# Altium schematic sheet LPCB218 - HEC1-4.SchDoc
size A3; Address1: Factory 10; Address2: 9-13 Dingley Avenue, Dandeong, VICTORIA 3175, AUSTRALIA; DocumentNumber: 6; Revision: 1; SheetNumber: 6; SheetTotal: 14; Lockie__PCB_SUB_ASSEMBLY: HEC 1-4; Lockie__PCB_ASSEMBLY: Command Node; Lockie__LDL: LPCB218; Lockie__PCB_DESCRIPTION: Command Node
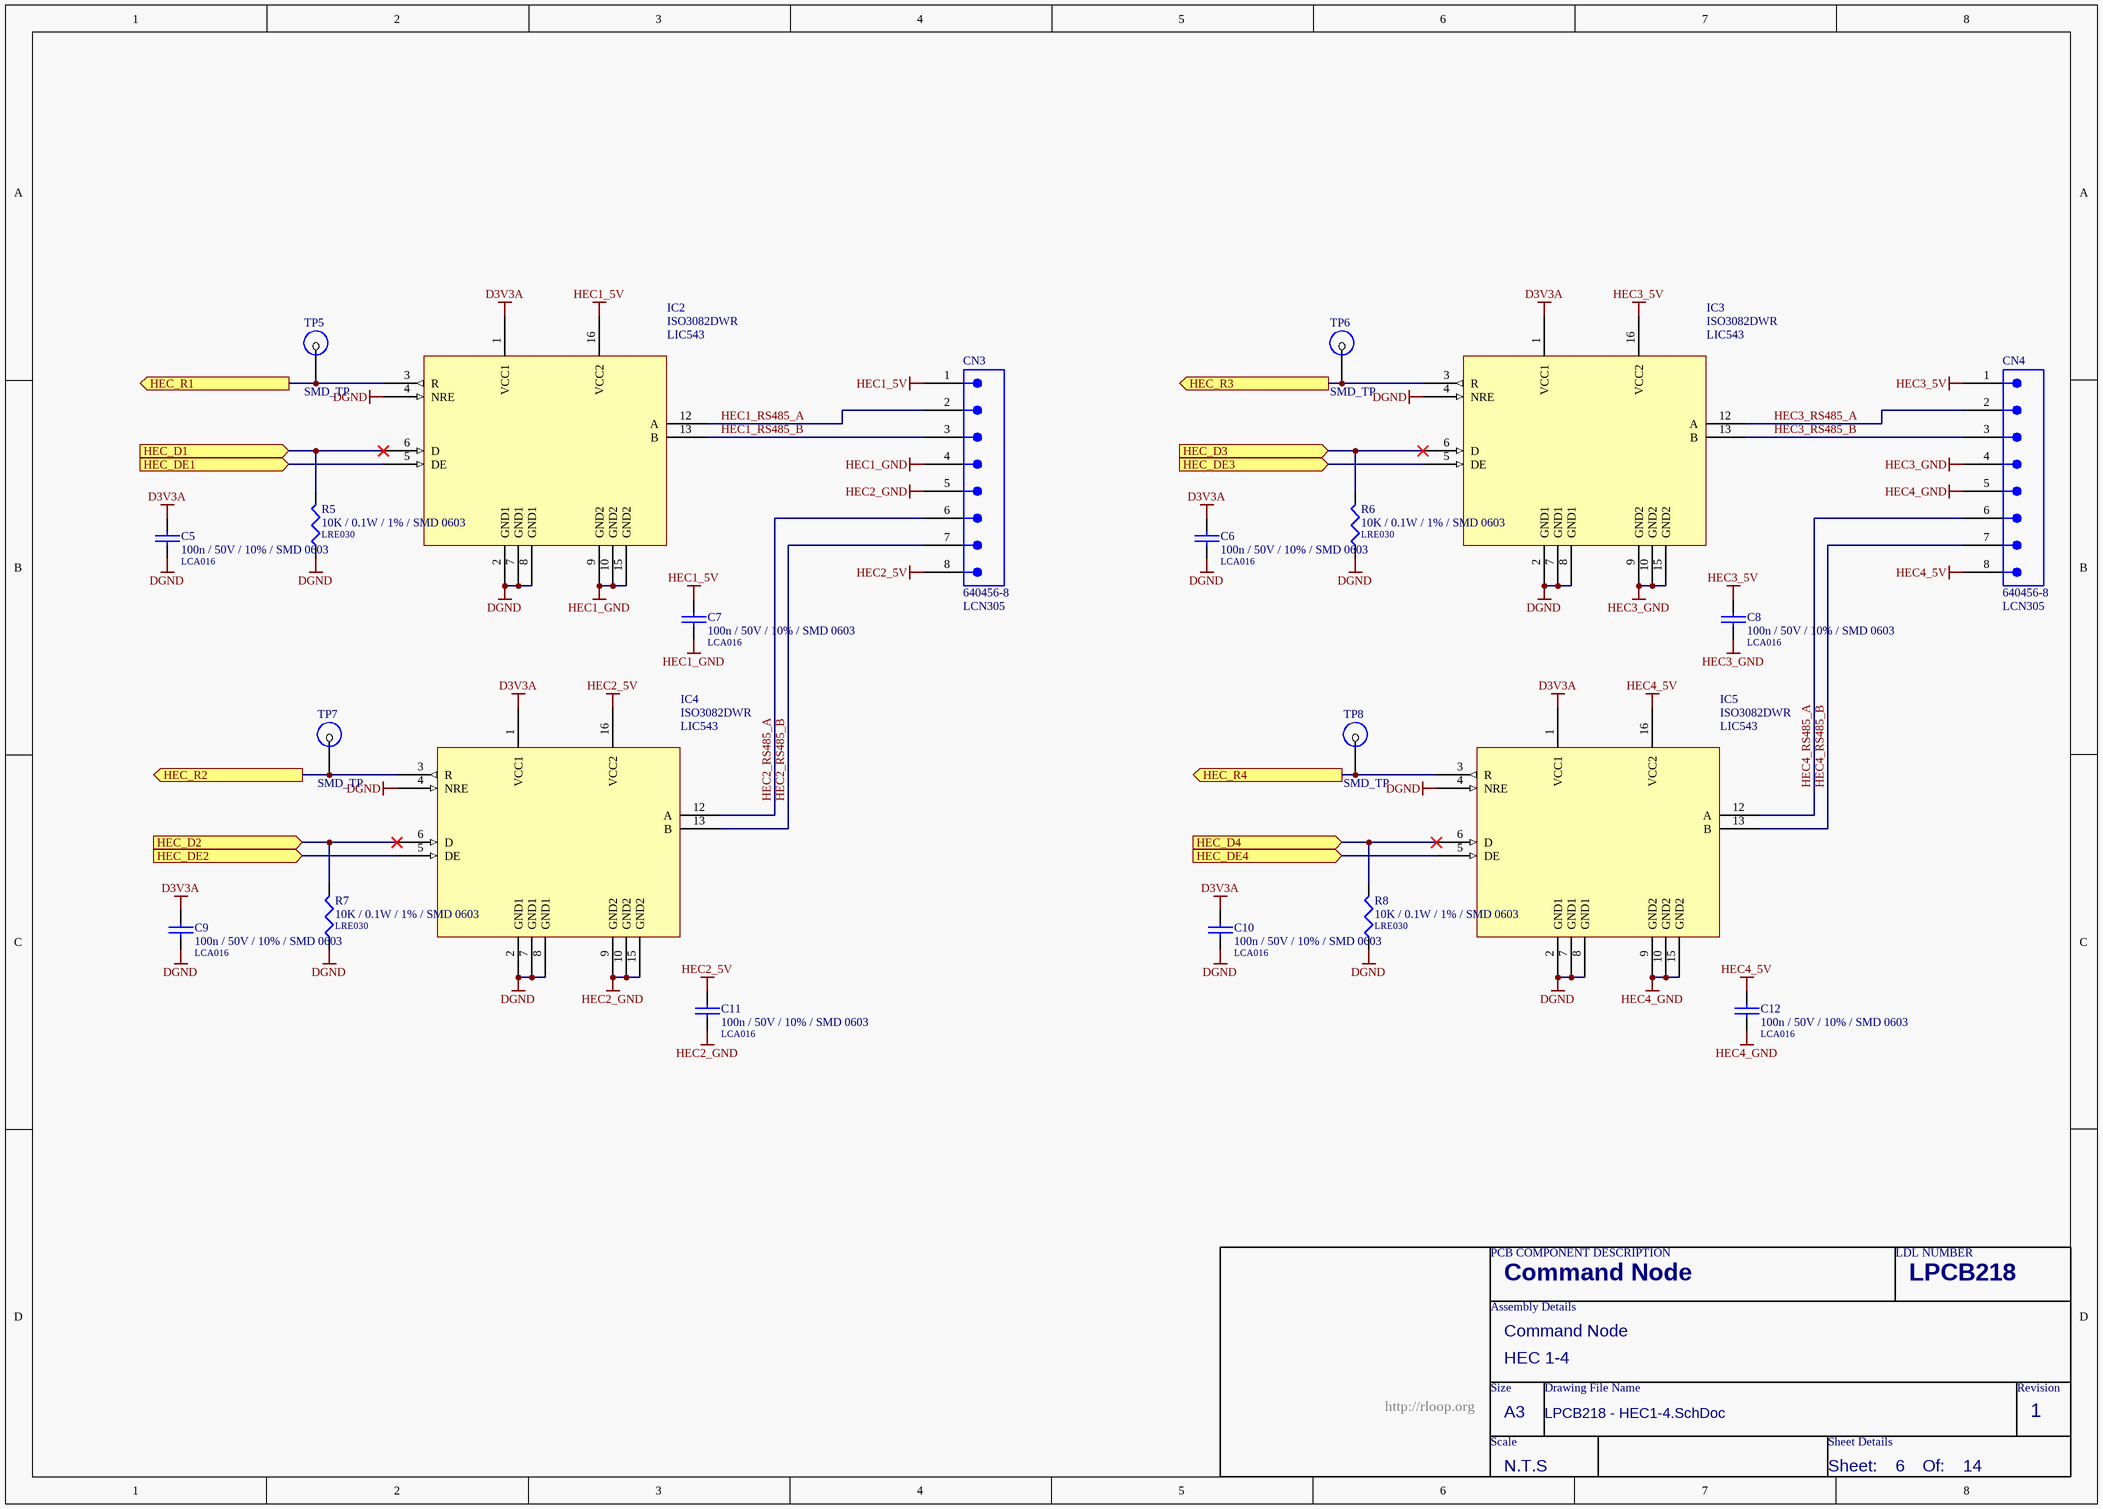
[diagram p0: LPCB218 - HEC1-4.SchDoc]

## Parts
C5  100n / 50V / 10% / SMD 0603  LDL_NUMBER: LCA016  [LFP011__CC1608-0603-IPC7351_B]
C6  100n / 50V / 10% / SMD 0603  LDL_NUMBER: LCA016  [LFP011__CC1608-0603-IPC7351_B]
C7  100n / 50V / 10% / SMD 0603  LDL_NUMBER: LCA016  [LFP011__CC1608-0603-IPC7351_B]
C8  100n / 50V / 10% / SMD 0603  LDL_NUMBER: LCA016  [LFP011__CC1608-0603-IPC7351_B]
C9  100n / 50V / 10% / SMD 0603  LDL_NUMBER: LCA016  [LFP011__CC1608-0603-IPC7351_B]
C10  100n / 50V / 10% / SMD 0603  LDL_NUMBER: LCA016  [LFP011__CC1608-0603-IPC7351_B]
C11  100n / 50V / 10% / SMD 0603  LDL_NUMBER: LCA016  [LFP011__CC1608-0603-IPC7351_B]
C12  100n / 50V / 10% / SMD 0603  LDL_NUMBER: LCA016  [LFP011__CC1608-0603-IPC7351_B]
CN3  640456-8  LDL_NUMBER: LCN305  [640456-8]
CN4  640456-8  LDL_NUMBER: LCN305  [640456-8]
IC2  ISO3082DWR  LDL_NUMBER: LIC543  [LFP068__SO-G16/G6.9]
IC3  ISO3082DWR  LDL_NUMBER: LIC543  [LFP068__SO-G16/G6.9]
IC4  ISO3082DWR  LDL_NUMBER: LIC543  [LFP068__SO-G16/G6.9]
IC5  ISO3082DWR  LDL_NUMBER: LIC543  [LFP068__SO-G16/G6.9]
R5  10K / 0.1W / 1% / SMD 0603  LDL_NUMBER: LRE030  [LFP020__CR1608-0603-IPC7351_B]
R6  10K / 0.1W / 1% / SMD 0603  LDL_NUMBER: LRE030  [LFP020__CR1608-0603-IPC7351_B]
R7  10K / 0.1W / 1% / SMD 0603  LDL_NUMBER: LRE030  [LFP020__CR1608-0603-IPC7351_B]
R8  10K / 0.1W / 1% / SMD 0603  LDL_NUMBER: LRE030  [LFP020__CR1608-0603-IPC7351_B]
TP5  SMD_TP  [SMD-TP]  (no BOM)
TP6  SMD_TP  [SMD-TP]  (no BOM)
TP7  SMD_TP  [SMD-TP]  (no BOM)
TP8  SMD_TP  [SMD-TP]  (no BOM)

## Ports
HEC_D1 (in), HEC_D2 (in), HEC_D3 (in), HEC_D4 (in), HEC_DE1 (in), HEC_DE2 (in), HEC_DE3 (in), HEC_DE4 (in), HEC_R1 (out), HEC_R2 (out), HEC_R3 (out), HEC_R4 (out)

## Nets
D3V3A: C5.1 C6.1 C9.1 C10.1 IC2.1(VCC1) IC3.1(VCC1) IC4.1(VCC1) IC5.1(VCC1)
DGND: C5.2 C6.2 C9.2 C10.2 IC2.2(GND1) IC2.4(NRE) IC2.7(GND1) IC2.8(GND1) IC3.2(GND1) IC3.4(NRE) IC3.7(GND1) IC3.8(GND1) IC4.2(GND1) IC4.4(NRE) IC4.7(GND1) IC4.8(GND1) IC5.2(GND1) IC5.4(NRE) IC5.7(GND1) IC5.8(GND1) R5.1 R6.1 R7.1 R8.1
HEC1_5V: C7.1 CN3.1 IC2.16(VCC2)
HEC1_GND: C7.2 CN3.4 IC2.9(GND2) IC2.10(GND2) IC2.15(GND2)
HEC2_5V: C11.1 CN3.8 IC4.16(VCC2)
HEC2_GND: C11.2 CN3.5 IC4.9(GND2) IC4.10(GND2) IC4.15(GND2)
HEC3_5V: C8.1 CN4.1 IC3.16(VCC2)
HEC3_GND: C8.2 CN4.4 IC3.9(GND2) IC3.10(GND2) IC3.15(GND2)
HEC4_5V: C12.1 CN4.8 IC5.16(VCC2)
HEC4_GND: C12.2 CN4.5 IC5.9(GND2) IC5.10(GND2) IC5.15(GND2)
HEC1_RS485_A: CN3.2 IC2.12(A)
HEC1_RS485_B: CN3.3 IC2.13(B)
HEC2_RS485_A: CN3.6 IC4.12(A)
HEC2_RS485_B: CN3.7 IC4.13(B)
HEC3_RS485_A: CN4.2 IC3.12(A)
HEC3_RS485_B: CN4.3 IC3.13(B)
HEC4_RS485_A: CN4.6 IC5.12(A)
HEC4_RS485_B: CN4.7 IC5.13(B)
HEC_D1: IC2.6(D) R5.2 ; port HEC_D1
HEC_D2: IC4.6(D) R7.2 ; port HEC_D2
HEC_D3: IC3.6(D) R6.2 ; port HEC_D3
HEC_D4: IC5.6(D) R8.2 ; port HEC_D4
HEC_DE1: IC2.5(DE) ; port HEC_DE1
HEC_DE2: IC4.5(DE) ; port HEC_DE2
HEC_DE3: IC3.5(DE) ; port HEC_DE3
HEC_DE4: IC5.5(DE) ; port HEC_DE4
HEC_R1: IC2.3(R) TP5.1 ; port HEC_R1
HEC_R2: IC4.3(R) TP7.1 ; port HEC_R2
HEC_R3: IC3.3(R) TP6.1 ; port HEC_R3
HEC_R4: IC5.3(R) TP8.1 ; port HEC_R4

## Notes on the sheet
- PCB COMPONENT DESCRIPTION
- LDL NUMBER
- Assembly Details
- Size
- Drawing File Name
- Revision
- http://rloop.org
- Scale
- A3
- Sheet Details
- N.T.S
- Sheet:
- Of:

## Library data of the parts
C5-C12 = 100n / 50V / 10% / SMD 0603: Capacitor, Ceramic Chip, 100nF (0.1uF), 50V, 5%, SMD 0603 [LCA016]; FMEDA__OPERATING__VOLTAGE_MIN: 0; FMEDA__OPERATING__VOLTAGE_MAX: 3.3; FMEDA__OPERATING__TEMP_MIN: -20; FMEDA__OPERATING__TEMP_TYP: 27; FMEDA__OPERATING__TEMP_MAX: 50; FMEDA__CHANNEL: COM; Value: 100n; FMEDA__FUNCTION_IN_SYSTEM: *; FMEDA__OPERATING__VOLTAGE_TYP: 3.3
CN3 CN4 = 640456-8: Connector, Male Header, 8 Way; FMEDA__CHANNEL: COM; FMEDA__OPERATING__CURRENT_MAX: 0; FMEDA__OPERATING__TEMP_MAX: 50; FMEDA__OPERATING__TEMP_MIN: -20; FMEDA__OPERATING__TEMP_TYP: 27; FMEDA__OPERATING__VOLTAGE_MAX: 16; FMEDA__OPERATING__VOLTAGE_TYP: 12; FMEDA__FUNCTION_IN_SYSTEM: *; FMEDA__OPERATING__CURRENT_MIN: 0; FMEDA__OPERATING__CURRENT_TYP: 0; FMEDA__OPERATING__VOLTAGE_MIN: 0
IC2-IC5 = ISO3082DWR: IC, RS485 Isolator, SMD SOIC 16 [LIC543]
R5-R8 = 10K / 0.1W / 1% / SMD 0603: Resistor, Ceramic Chip, 10K, 0.1W, 1%, SMD 0603 [LRE030]; FMEDA__OPERATING__POWER_MAX: 0; FMEDA__OPERATING__TEMP_MAX: 50; FMEDA__OPERATING__TEMP_MIN: -20; FMEDA__OPERATING__TEMP_TYP: 27; FMEDA__CHANNEL: COM; Value: 10K; FMEDA__OPERATING__POWER_MIN: 0; FMEDA__OPERATING__VOLTAGE_MAX: 0; FMEDA__OPERATING__VOLTAGE_MIN: 0; FMEDA__OPERATING__VOLTAGE_TYP: 0; FMEDA__FUNCTION_IN_SYSTEM: *
TP5-TP8 = SMD_TP: SMD Test Point; FMEDA__CHANNEL: COM; FMEDA__OPERATING__CURRENT_MAX: 0; FMEDA__OPERATING__TEMP_MAX: 50; FMEDA__OPERATING__TEMP_MIN: -20; FMEDA__OPERATING__TEMP_TYP: 27; FMEDA__OPERATING__VOLTAGE_MAX: 16; FMEDA__OPERATING__VOLTAGE_TYP: 12; FMEDA__OPERATING__CURRENT_MIN: 0; FMEDA__OPERATING__CURRENT_TYP: 0; FMEDA__OPERATING__VOLTAGE_MIN: 0